# EAGLE schematic PM12VPowerSupp (EAGLE 7.7.0)
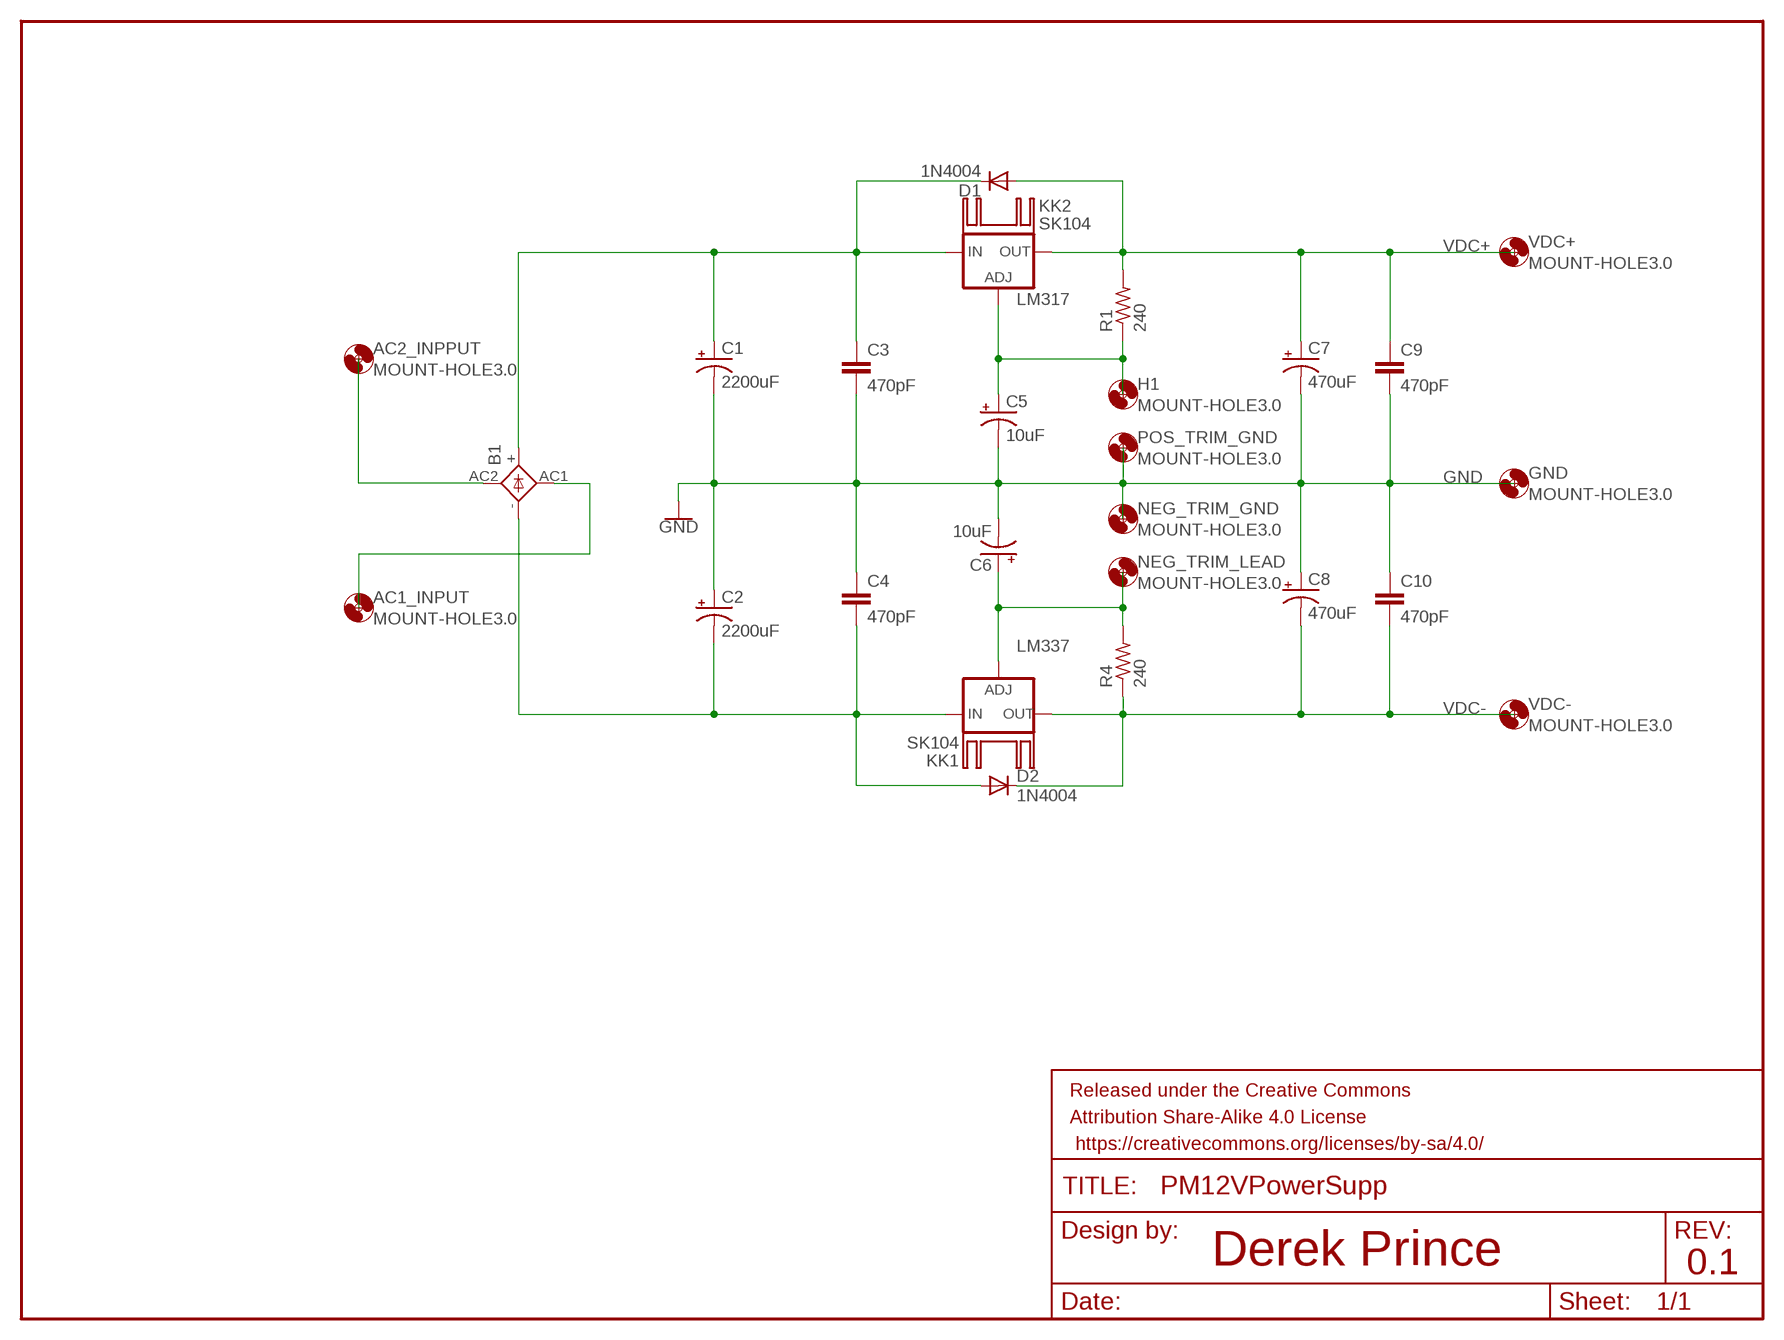
[diagram p0: schematic, sheet 1]

## Parts
AC1_INPUT  MOUNT-HOLE3.0  [3,0]
AC2_INPPUT  MOUNT-HOLE3.0  [3,0]
B1  GBU4  [GBU4S]
C1  2200uF  CPOL-USE7.5-16  [E7,5-16]
C2  2200uF  CPOL-USE7.5-16  [E7,5-16]
C3  470pF  C-EU050-024X044  [C050-024X044]
C4  470pF  C-EU050-024X044  [C050-024X044]
C5  10uF  CPOL-USE2-5  [E2-5]
C6  10uF  CPOL-USE2-5  [E2-5]
C7  470uF  CPOL-USE5-10.5  [E5-10,5]
C8  470uF  CPOL-USE5-10.5  [E5-10,5]
C9  470pF  C-EU050-024X044  [C050-024X044]
C10  470pF  C-EU050-024X044  [C050-024X044]
D1  1N4004  [DO41-10]
D2  1N4004  [DO41-10]
FRAME1  FRAME-LETTER  [CREATIVE_COMMONS]
GND  MOUNT-HOLE3.0  [3,0]
H1  MOUNT-HOLE3.0  [3,0]
KK1  SK104  [SK104]
KK2  SK104  [SK104]
LM317  LM317TS  [317TS]
LM337  LM337TS  [337TS]
NEG_TRIM_GND  MOUNT-HOLE3.0  [3,0]
NEG_TRIM_LEAD  MOUNT-HOLE3.0  [3,0]
POS_TRIM_GND  MOUNT-HOLE3.0  [3,0]
R1  240  R-US_0309/12  [0309/12]
R4  240  R-US_0309/12  [0309/12]
VDC+  MOUNT-HOLE3.0  [3,0]
VDC-  MOUNT-HOLE3.0  [3,0]

## Nets
GND: C1.- C2.+ C3.2 C4.1 C5.- C6.- C7.- C8.+ C9.2 C10.1
N$1: B1.AC1(AC2)
N$2: C6.+ LM337.1(ADJ) R4.2
N$3: B1.AC2(AC1)
N$4: B1.- C2.- C4.2 D2.A LM337.2(IN)
N$5: B1.+ C1.+ C3.1 D1.C LM317.3(IN)
POS_TRIM_LEAD: C5.+ LM317.1(ADJ) R1.1
VDC+: C7.+ C9.1 D1.A LM317.2(OUT) R1.2
VDC-: C8.- C10.2 D2.C LM337.3(OUT) R4.1

## Notes on the sheet
- Derek Prince | 0.1

## Library data of the parts
AC1_INPUT AC2_INPPUT GND H1 NEG_TRIM_GND NEG_TRIM_LEAD POS_TRIM_GND VDC+ VDC- = holes:MOUNT-HOLE: MOUNTING HOLE with drill center marker
B1 = rectifier:GBU4: GENERAL INSTRUMENT RECTIFIER
C1 C2 C5-C8 = rcl:CPOL-US: POLARIZED CAPACITOR, American symbol
C3 C4 C9 C10 = rcl:C-EU: CAPACITOR, European symbol
D1 D2 = diode:1N4004: DIODE general purpose rectifier, 1 A
FRAME1 = SparkFun-Aesthetics:FRAME-LETTER: Schematic Frame - Letter Standard 8.5x11 US Letter frame
KK1 KK2 = heatsink:SK104: HEATSINK manufacturer Fischer/distributor Buerklin
LM317 = v-reg:LM317TS: VOLTAGE REGULATOR
LM337 = v-reg:LM337TS: VOLTAGE REGULATOR
R1 R4 = resistor:R-US_: RESISTOR, American symbol